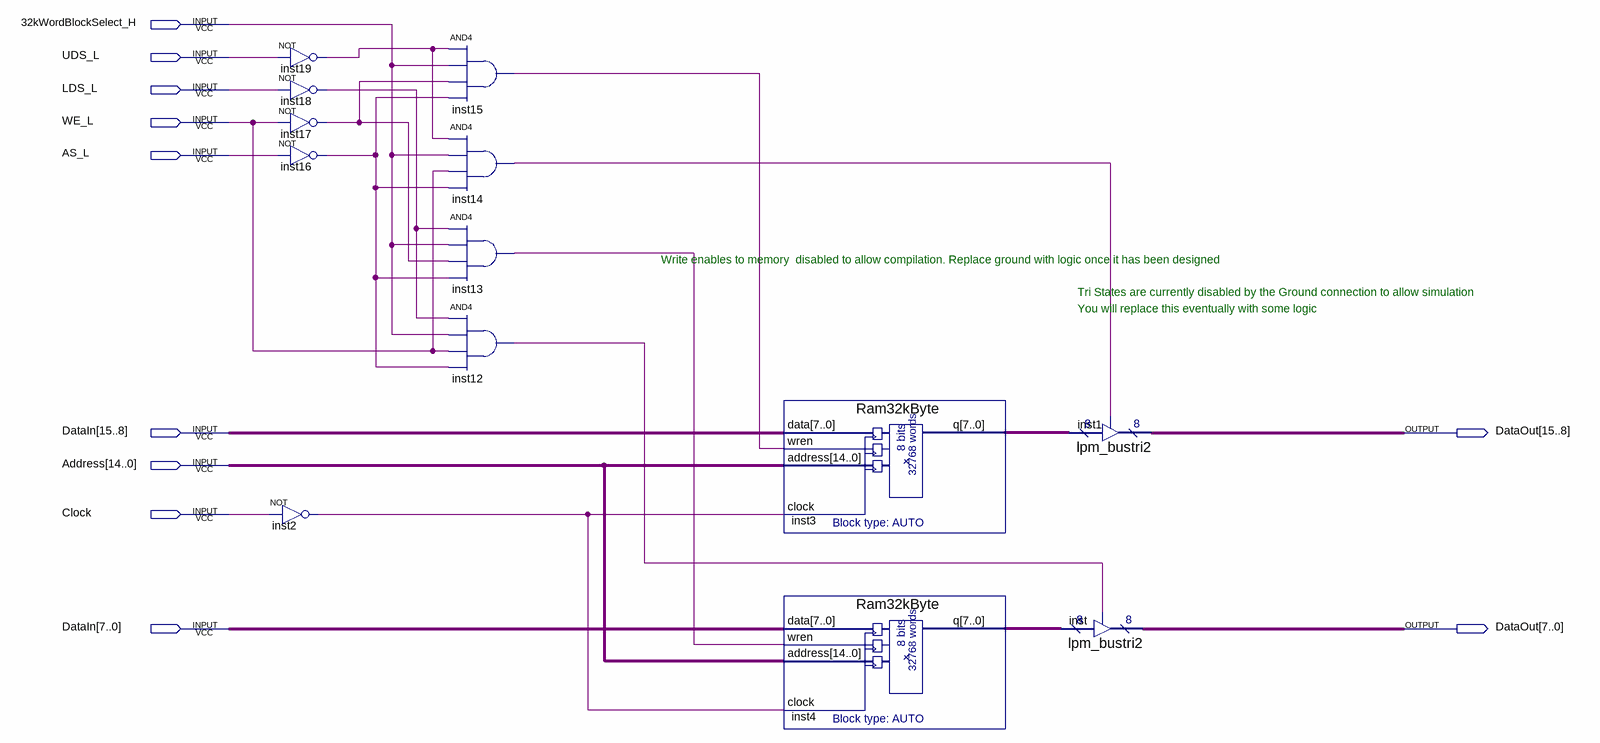
[diagram p0: schematic sheet]
// Quartus schematic SramBlock_32KWord.bdf as structural Verilog: 13 symbols, 11 pins
module SramBlock_32KWord (
  input  \32kWordBlockSelect_H ,
  input  UDS_L,
  input  LDS_L,
  input  WE_L,
  input  AS_L,
  input  [15:0] DataIn,
  input  [14:0] Address,
  input  Clock,
  output [15:0] DataOut
);

  wire inst2_out, inst12_out, inst13_out, inst14_out, inst15_out, inst16_out, inst17_out, inst18_out,
       inst19_out;
  wire [7:0] inst3_q, inst4_q;

  not inst19 (inst19_out, UDS_L);
  not inst18 (inst18_out, LDS_L);
  not inst17 (inst17_out, WE_L);
  not inst16 (inst16_out, AS_L);
  not inst2 (inst2_out, Clock);
  and inst15 (inst15_out, inst19_out, \32kWordBlockSelect_H , inst17_out, inst16_out);
  and inst14 (inst14_out, inst19_out, \32kWordBlockSelect_H , WE_L, inst16_out);
  and inst13 (inst13_out, inst18_out, \32kWordBlockSelect_H , inst17_out, inst16_out);
  and inst12 (inst12_out, inst18_out, \32kWordBlockSelect_H , WE_L, inst16_out);
  Ram32kByte inst3 (.data(DataIn[15:8]), .wren(inst15_out), .address(Address), .clock(inst2_out), .q(inst3_q));
  Ram32kByte inst4 (.data(DataIn[7:0]), .wren(inst13_out), .address(Address), .clock(inst2_out), .q(inst4_q));
  lpm_bustri2 inst1 (.enabledt(inst14_out), .data(inst3_q), .tridata(DataOut[15:8]));
  lpm_bustri2 inst (.enabledt(inst12_out), .data(inst4_q), .tridata(DataOut[7:0]));

  // Notes on the sheet:
  //   Write enables to memory  disabled to allow compilation. Replace ground with logic once it has been designed
  //   Tri States are currently disabled by the Ground connection to allow simulation
  //   You will replace this eventually with some logic
endmodule
